# EAGLE design circuit (EAGLE 6.5.0)
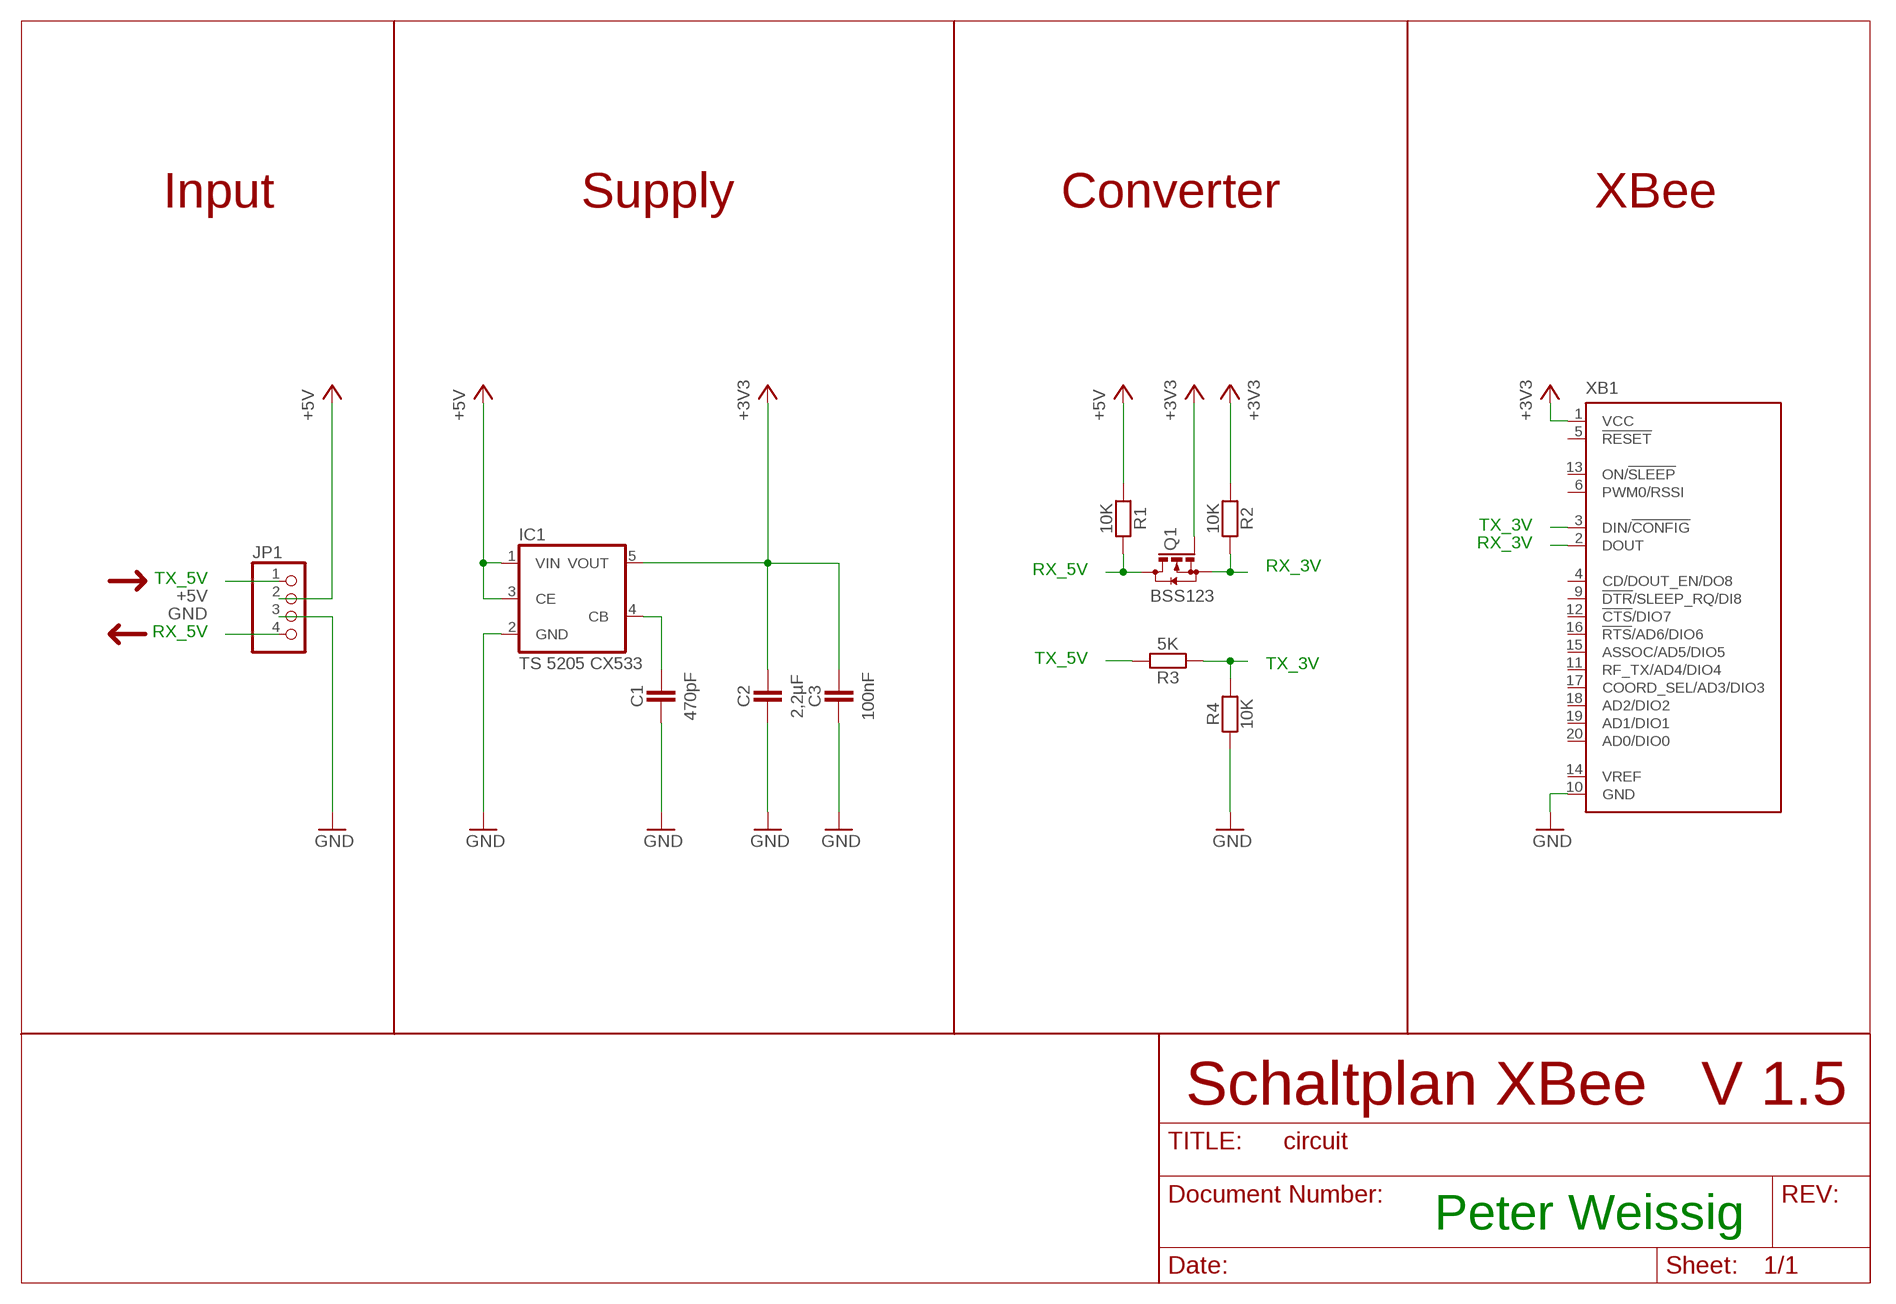
[diagram p0: schematic, sheet 1]

## Parts
C1  470pF  CAPACITATOR-1206  [SMD_1206]
C2  2,2µF  CAPACITATOR-1206  [SMD_1206]
C3  100nF  CAPACITATOR-1206  [SMD_1206]
IC1  TS 5205 CX533  TS520533  [SOT25]
JP1  PINHD-1X4  [1X04]
Q1  BSS123  [SOT23]
R1  10K  RESISTOR-1206  [SMD_1206]
R2  10K  RESISTOR-1206  [SMD_1206]
R3  5K  RESISTOR-1206  [SMD_1206]
R4  10K  RESISTOR-1206  [SMD_1206]
XB1  XBEESMD  [FUNK_XBEE2]

## Nets
+3V3: C2.1 C3.1 IC1.5(VOUT) Q1.1(G) R2.2 XB1.1(VCC)
+5V: IC1.1(VIN) IC1.3(CE) JP1.2 R1.2
GND: C1.2 C2.2 C3.2 IC1.2(GND) JP1.3 R4.2 XB1.10(GND)
N$1: C1.1 IC1.4(CB)
RX_3V: Q1.2(S) R2.1 XB1.2(DOUT)
RX_5V: JP1.4 Q1.3(D) R1.1
TX_3V: R3.2 R4.1 XB1.3(DIN/!CONFIG)
TX_5V: JP1.1 R3.1
Unconnected: XB1.4(CD/DOUT_EN/DO8) XB1.5(!RESET) XB1.6(PWM0/RSSI) XB1.9(!DTR!/SLEEP_RQ/DI8) XB1.11(RF_TX/AD4/DIO4) XB1.12(!CTS!/DIO7) XB1.13(ON/!SLEEP) XB1.14(VREF) XB1.15(ASSOC/AD5/DIO5) XB1.16(!RTS!/AD6/DIO6) XB1.17(COORD_SEL/AD3/DIO3) XB1.18(AD2/DIO2) XB1.19(AD1/DIO1) XB1.20(AD0/DIO0)

## Notes on the sheet
- Input | Supply | Converter | XBee
- Schaltplan XBee | V 1.5
- Peter Weissig

## Library data of the parts
C1-C3 = robo_ag:CAPACITATOR: Kondensator
IC1 = v-reg:TS5205: 150mA Low Noise LDO Voltage Regulator with Enable TSC [Taiwan Semiconductor Company, Ltd] Source: http://www.taiwansemi.com .. 5205_0409c.pdf
JP1 = pinhead:PINHD-1X4: PIN HEADER
Q1 = transistor-small-signal:BSS123: N-CHANNEL MOS FET
R1-R4 = robo_ag:RESISTOR: Widerstand
XB1 = robo_ag:XBEE: XBee (TM) /XBee-PRO(TM) OEM RF Modules Source: MaxStream, Inc. xbee_productmanual.pdf

## Board
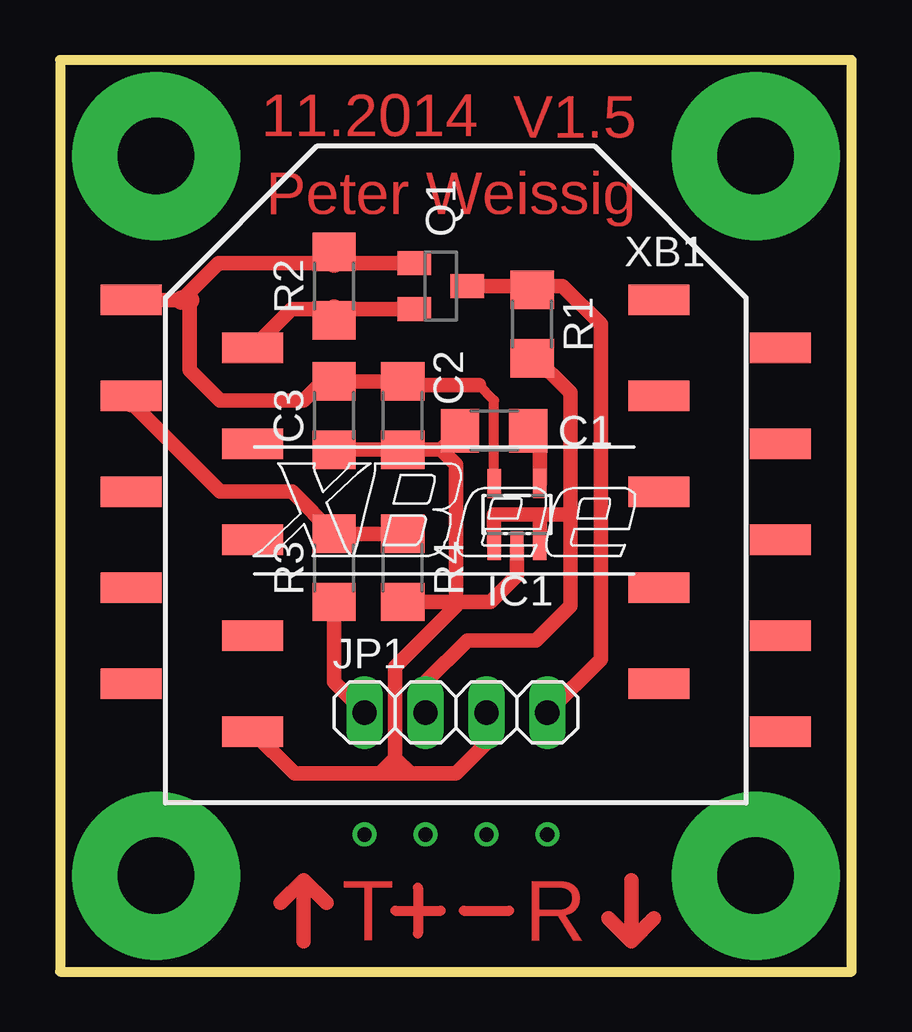
[diagram p1: board, top side]

Size 33 x 38 mm. Coordinates in mm from the lower left corner, seen from the top.
Outline: 0,0 33,0 33,38 0,38 0,0
Copper layers (1*16): Top 0.035mm / dielectric 1.5mm / Bottom 0.035mm
Design rules "default": minimum track width 10mil, minimum drill 24mil, track to track 8mil, track to pad 8mil, pad to pad 8mil, via to via 8mil, smd to smd 8mil, copper to edge 40mil, drill to drill 8mil, minimum pad ring 10mil, minimum via ring 8mil, stop-mask expansion 4mil, vias tented up to drill 0mil, thermal gap 10mil

### Footprints (pad centres in the part's own frame; a part is rotated, then mirrored left to right if it is on the bottom)
SMD_1206 = smd 1.6 x 1.803: 1 -1.422,0; 2 1.422,0
SOT25 = smd 0.55 x 1.2: 1 -0.95,-1.3; 2 0,-1.3; 3 0.95,-1.3; 4 0.95,1.3; 5 -0.95,1.3
1X04 = drill 1.016 long: 1 -3.81,0; 2 -1.27,0; 3 1.27,0; 4 3.81,0
SOT23 = smd 1 x 1.4: 1 -0.95,-1.1; 2 0.95,-1.1; 3 0,1.1
FUNK_XBEE2 = smd 2.54 x 1.27: 1 -13.54,9; 2 -8.46,7; 3 -13.54,5; 4 -8.46,3; 5 -13.54,1; 6 -8.46,-1; 7 -13.54,-3; 8 -8.46,-5; 9 -13.54,-7; 10 -8.46,-9; 11 13.54,-9; 12 8.46,-7; 13 13.54,-5; 14 8.46,-3; 15 13.54,-1; 16 8.46,1; 17 13.54,3; 18 8.46,5; 19 13.54,7; 20 8.46,9

### Placement (x,y rotation side)
C1  18.1,22.54 180 top
C2  14.29,23.18 270 top
C3  11.43,23.18 270 top
IC1  19.05,19.05 0 top
JP1  16.51,10.79 0 top
Q1  15.88,28.57 270 top
R1  19.68,26.99 270 top
R2  11.43,28.57 90 top
R3  11.43,16.83 90 top
R4  14.29,16.83 270 top
XB1  16.5,19 0 top

### Tracks (layer width: path | path; a pad name or v marks a point on that pad's centre or on a via)
+3V3
  Top 0.406: IC1.5 18.1,23.81 17.46,24.45
  Top 0.61: XB1.1 5.08,28 6.61,29.52 11.43,29.52 Q1.1 | 5.4,28 5.4,25.08 6.67,23.81 10.16,23.81 10.95,24.6 C3.1 C2.1 14.44,24.45 17.46,24.45
  Top 0.813: 5.08,28 5.4,28 | R2.2 11.43,29.52
+5V
  Top 0.61: 19.68,25.72 21.27,24.13 21.27,19.05 | 21.27,19.05 21.27,15.24 19.84,13.81 16.99,13.81 15.24,12.06 JP1.2 | IC1.1 18.1,19.05 20,19.05 | 20,19.05 IC1.3 20,19.05 | 20,19.05 21.27,19.05
  Top 0.813: R1.2 19.68,25.72
GND
  Top 0.61: 9.47,8.57 XB1.10 9.79,8.26 13.34,8.26 | R4.2 16.51,15.4 | 16.51,15.4 17.95,15.4 19.05,16.51 IC1.2 | C1.2 15.89,21.76 | 15.89,21.76 C2.2 C3.2 | 15.89,21.76 16.51,21.13 16.51,15.4 | 13.34,8.26 13.97,8.89 | 13.97,8.89 13.97,12.7 16.51,15.24 16.51,15.4 | JP1.3 17.78,9.53 16.51,8.26 14.61,8.26 | 14.61,8.26 13.34,8.26 | 13.97,8.89 14.61,8.26
N$1
  Top 0.61: IC1.4 20,22.06 C1.1
N$2  (via drill 3.2 pad 7)
  other vias: 4,4
N$3  (via drill 3.2 pad 7)
  other vias: 4,34
N$4  (via drill 3.2 pad 7)
  other vias: 29,4
N$5  (via drill 3.2 pad 7)
  other vias: 29,34
N$6
  Top 0.406: 13.97,2.54 15.88,2.54
N$7
  Top 0.406: 16.83,2.54 18.73,2.54
N$8
  Top 0.406: 14.92,3.49 14.92,1.59
N$9
  Top 0.61: 10.16,3.81 10.16,1.27 | 10.16,3.81 9.21,2.86 | 10.16,3.81 11.11,2.86
N$10
  Top 0.61: 23.81,3.81 23.81,1.27 | 23.81,1.27 22.86,2.22 | 23.81,1.27 24.77,2.22
N$11  (via drill 0.6 pad 1)
  other vias: 12.7,5.71
N$12  (via drill 0.6 pad 1)
  other vias: 15.24,5.71
N$13  (via drill 0.6 pad 1)
  other vias: 17.78,5.71
N$14  (via drill 0.6 pad 1)
  other vias: 20.32,5.71
RX_3V
  Top 0.61: Q1.2 11.43,27.62 9.66,27.62 XB1.2
  Top 0.813: XB1.2 8.04,26.04 | R2.1 11.43,27.62
RX_5V
  Top 0.61: 19.68,28.57 20.95,28.57 22.54,26.99 22.54,13.01 JP1.4 | 19.68,28.57 Q1.3 | R1.1 19.68,28.57
TX_3V
  Top 0.61: R4.1 R3.2 9.68,20 6.67,20 2.96,23.71
  Top 0.813: XB1.3 2.96,23.71
TX_5V
  Top 0.61: R3.1 11.43,12.06 JP1.1
  Top 0.813: R3.1 11.44,15.4

### Text on the board
Top: 11.2014 | V1.5 | Peter Weissig | T | R